# Altium schematic sheet Audio.SchDoc
size A4; SheetNumber: 5; SheetTotal: 9
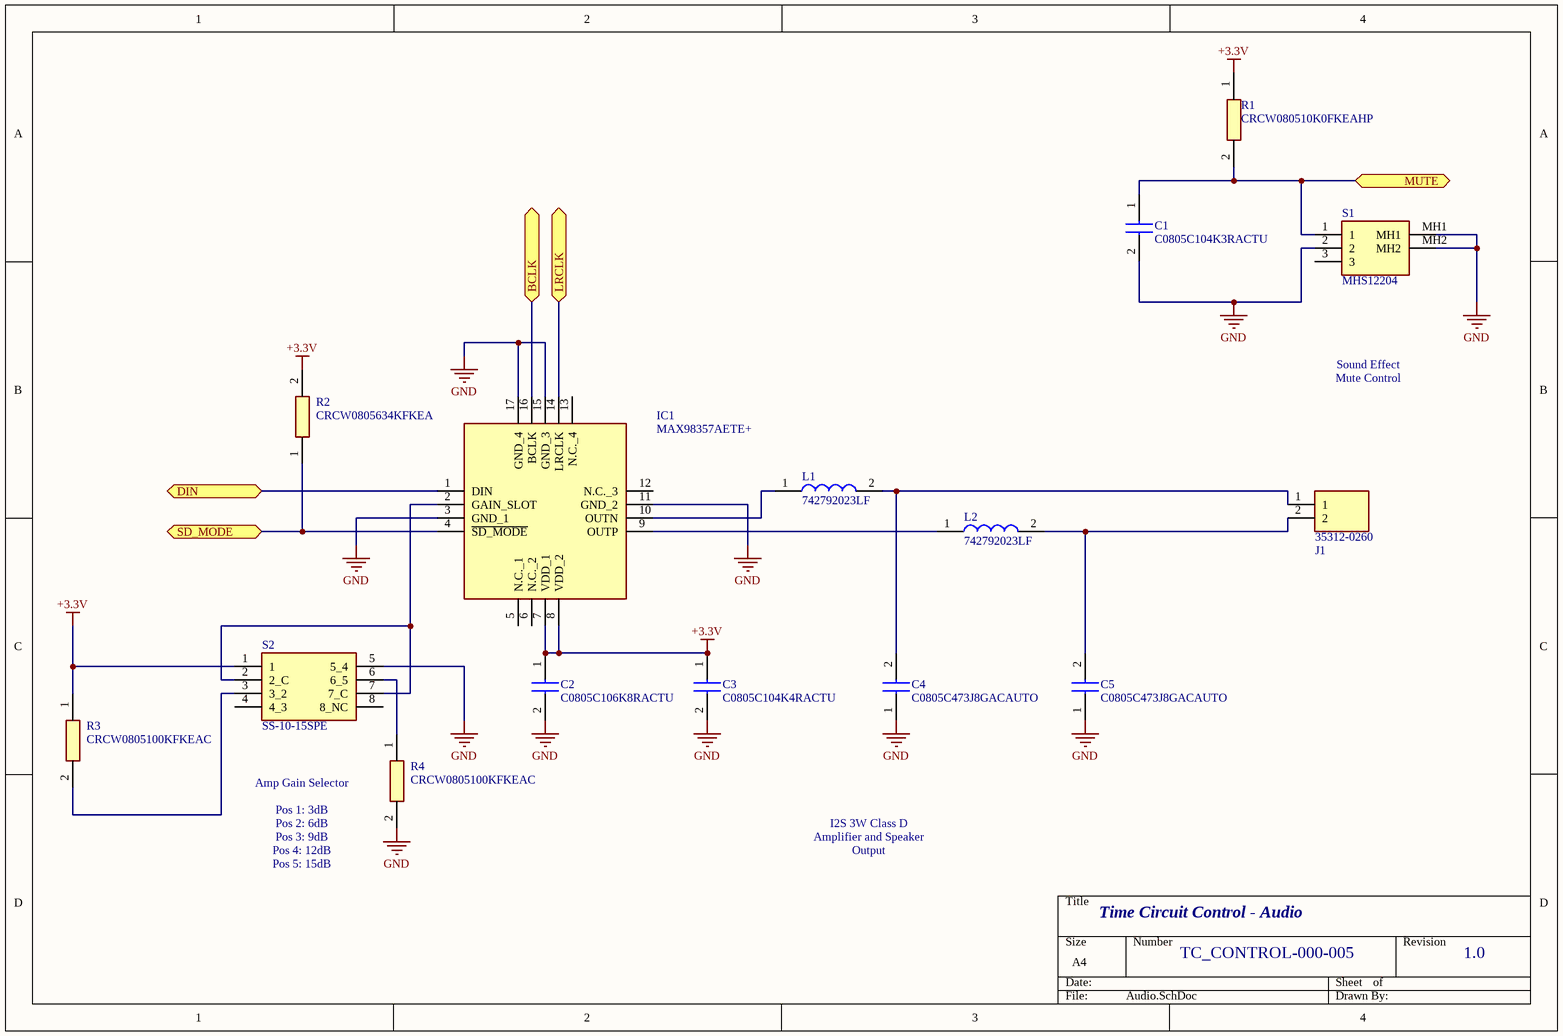
[diagram p0: Audio.SchDoc]

## Parts
C1  C0805C104K3RACTU  [CAPC2012X88N]
C2  C0805C106K8RACTU  [C0805]
C3  C0805C104K4RACTU  [CAPC2012X88N]
C4  C0805C473J8GACAUTO  [C0805]
C5  C0805C473J8GACAUTO  [C0805]
IC1  MAX98357AETE+  [QFN50P300X300X80-17N]
J1  35312-0260  [SHDR2W64P0X250_1X2_746X650X700P]
L1  742792023LF  [CAPC2012X110N]
L2  742792023LF  [CAPC2012X110N]
R1  CRCW080510K0FKEAHP  [RESC2012X60N]
R2  CRCW0805634KFKEA  [RESC2012X50N]
R3  CRCW0805100KFKEAC  [RESC2012X60N]
R4  CRCW0805100KFKEAC  [RESC2012X60N]
S1  MHS12204  [MHS12204]
S2  SS-10-15SPE  [SS1015SPE]

## Ports
BCLK, DIN, LRCLK, MUTE, SD_MODE

## Nets
+3.3V: C2.1 C3.1 IC1.7(VDD_1) IC1.8(VDD_2) R1.1 R2.2 R3.1 S2.1
GND: C1.2 C2.2 C3.2 C4.1 C5.1 IC1.3(GND_1) IC1.11(GND_2) IC1.15(GND_3) IC1.17(GND_4) R4.2 S1.2 S1.MH1 S1.MH2 S2.5(5_4)
BCLK: IC1.16(BCLK) ; port BCLK
DIN: IC1.1(DIN) ; port DIN
LRCLK: IC1.14(LRCLK) ; port LRCLK
MUTE: C1.1 R1.2 S1.1 ; port MUTE
SD_MODE: IC1.4(~{SD_MODE}) R2.1 ; port SD_MODE
NetC4_2: C4.2 J1.1 L1.2
NetC5_2: C5.2 J1.2 L2.2
NetIC1_2: IC1.2(GAIN_SLOT) S2.2(2_C) S2.7(7_C)
NetIC1_9: IC1.9(OUTP) L2.1
NetIC1_10: IC1.10(OUTN) L1.1
NetR3_2: R3.2 S2.3(3_2)
NetR4_1: R4.1 S2.6(6_5)

Not connected (* = marked no-connect by the designer): IC1 5(N.C._1) 6(N.C._2) 12(N.C._3) 13(N.C._4); S1 3; S2 4(4_3) 8(8_NC)

## Notes on the sheet
- Sound Effect
  Mute Control
- I2S 3W Class D
  Amplifier and Speaker Output
- (near R4) Amp Gain Selector
  Pos 1: 3dB
  Pos 2: 6dB
  Pos 3: 9dB
  Pos 4: 12dB
  Pos 5: 15dB
- Time Circuit Control - Audio
- TC_CONTROL-000-005
- 1.0

## Library data of the parts
C1 = C0805C104K3RACTU: Capacitor; Manufacturer_Name: Kemet; Datasheet Link: https://componentsearchengine.com/Datasheets/2/C0805C104K3RACTU.pdf; Height: 0.88mm; Manufacturer_Part_Number: C0805C104K3RACTU; Mouser Part Number: 80-C0805C104K3R; Mouser Price/Stock: https://www.mouser.co.uk/ProductDetail/KEMET/C0805C104K3RACTU?qs=zZwvocWqSRjmUvfNxkIN%2Fg%3D%3D; Arrow Part Number: C0805C104K3RACTU; Arrow Price/Stock: https://www.arrow.com/en/products/c0805c104k3ractu/kemet-corporation
C2 = C0805C106K8RACTU: Capacitor; Manufacturer_Name: KEMET; Datasheet Link: https://content.kemet.com/datasheets/KEM_C1002_X7R_SMD.pdf; Height: 1.1mm; Manufacturer_Part_Number: C0805C106K8RACTU; Mouser Part Number: 80-C0805C106K8R; Mouser Price/Stock: https://www.mouser.co.uk/ProductDetail/KEMET/C0805C106K8RACTU?qs=iP0bYSAMAFqUyr6Ql6ZwXw%3D%3D; Arrow Part Number: C0805C106K8RACTU; Arrow Price/Stock: https://www.arrow.com/en/products/c0805c106k8ractu/kemet-corporation?region=nac
C3 = C0805C104K4RACTU: Capacitor; Manufacturer_Name: Kemet; Datasheet Link: http://docs-emea.rs-online.com/webdocs/134c/0900766b8134ce68.pdf; Height: 0.88mm; Manufacturer_Part_Number: C0805C104K4RACTU; Arrow Part Number: C0805C104K4RACTU; Arrow Price/Stock: https://www.arrow.com/en/products/c0805c104k4ractu/kemet-corporation; Mouser Part Number: 80-C0805C104K4R; Mouser Price/Stock: https://www.mouser.co.uk/ProductDetail/KEMET/C0805C104K4RACTU?qs=Pc30aiB8zWWfqQNJWggt%252BA%3D%3D
C4 C5 = C0805C473J8GACAUTO: Capacitor; Manufacturer_Name: KEMET; Datasheet Link: https://content.kemet.com/datasheets/KEM_C1022_C0G_AUTO_SMD.pdf; Height: 1.1mm; Manufacturer_Part_Number: C0805C473J8GACAUTO; Mouser Part Number: 80-C0805C473J8GAUTO; Mouser Price/Stock: https://www.mouser.co.uk/ProductDetail/KEMET/C0805C473J8GACAUTO?qs=ds50AKTGxA9OMfMZaj%2FzcA%3D%3D
IC1 = MAX98357AETE+: Integrated Circuit; Manufacturer_Name: Maxim Integrated; Datasheet Link: https://datasheets.maximintegrated.com/en/ds/MAX98357A-MAX98357B.pdf; Height: 0.8mm; Manufacturer_Part_Number: MAX98357AETE+; Mouser Part Number: 700-MAX98357AETE+; Mouser Price/Stock: https://www.mouser.co.uk/ProductDetail/Maxim-Integrated/MAX98357AETE%2b?qs=AAveGqk956EyS6m3AmZeuw%3D%3D
J1 = 35312-0260: Connector; Manufacturer_Name: Molex; Datasheet Link: https://www.molex.com/pdm_docs/sd/353120260_sd.pdf; Height: 7mm; Manufacturer_Part_Number: 35312-0260; Mouser Part Number: 538-35312-0260; Mouser Price/Stock: https://www.mouser.co.uk/ProductDetail/Molex/35312-0260?qs=yk4OKw9K9iIhFPrGnuA8uA%3D%3D
L1 L2 = 742792023LF: Inductor; Manufacturer_Name: Wurth Elektronik; Datasheet Link: https://www.digikey.in/en/products/detail/w%C3%BCrth-elektronik/742792023/1639017?s=N4IgTCBcDaIOwBYxwJxgAxgMwAIQF0BfIA; Height: 1.1mm; Manufacturer_Part_Number: 742792023LF
R1 = CRCW080510K0FKEAHP: Resistor; Manufacturer_Name: Vishay; Datasheet Link: https://componentsearchengine.com/Datasheets/1/CRCW08051R00FKEAHP.pdf; Height: 0.6mm; Manufacturer_Part_Number: CRCW080510K0FKEAHP; Mouser Part Number: 71-CRCW080510K0FKEAH; Mouser Price/Stock: https://www.mouser.co.uk/ProductDetail/Vishay-Dale/CRCW080510K0FKEAHP/?qs=FlFvgi4rxBybVOW6oiRQjA%3D%3D; Arrow Part Number: CRCW080510K0FKEAHP; Arrow Price/Stock: https://www.arrow.com/en/products/crcw080510k0fkeahp/vishay
R2 = CRCW0805634KFKEA: Resistor; Manufacturer_Name: Vishay; Datasheet Link: http://www.vishay.com/docs/20035/dcrcwe3.pdf; Height: 0.5mm; Manufacturer_Part_Number: CRCW0805634KFKEA; Mouser Part Number: 71-CRCW0805634KFKEA; Mouser Price/Stock: https://www.mouser.com/Search/ProductDetail.aspx?qs=EhwKGB4UJflfbl5wVdh81Q%3d%3d
R3 R4 = CRCW0805100KFKEAC: Resistor; Manufacturer_Name: Vishay; Datasheet Link: https://mouser.componentsearchengine.com/Datasheets/1/CRCW0805100KFKEAC.pdf; Height: 0.6mm; Manufacturer_Part_Number: CRCW0805100KFKEAC; Mouser Part Number: 71-CRCW0805100KFKEAC; Mouser Price/Stock: https://www.mouser.co.uk/ProductDetail/Vishay-Dale/CRCW0805100KFKEAC?qs=E3Y5ESvWgWORJvbAiaO1ug%3D%3D; Arrow Part Number: CRCW0805100KFKEAC; Arrow Price/Stock: https://www.arrow.com/en/products/crcw0805100kfkeac/vishay?region=nac
S1 = MHS12204: Switch; Manufacturer_Name: TE Connectivity; Datasheet Link: https://www.te.com/commerce/DocumentDelivery/DDEController?Action=srchrtrv&DocNm=1825255&DocType=Customer+Drawing&DocLang=English&DocFormat=pdf&PartCntxt=1825255-1; Height: 12mm; Manufacturer_Part_Number: MHS12204; Mouser Part Number: 506-MHS12204; Mouser Price/Stock: https://www.mouser.co.uk/ProductDetail/TE-Connectivity-Alcoswitch/MHS12204?qs=x%2FgbKjZ2T%2FPUluB%2FWhqq0Q%3D%3D; Arrow Part Number: MHS12204; Arrow Price/Stock: https://www.arrow.com/en/products/mhs12204/te-connectivity?region=nac
S2 = SS-10-15SPE: Switch; Manufacturer_Name: Copal Electronics; Datasheet Link: https://www.nidec-copal-electronics.com/e/catalog/switch/ss-10&s-2050.pdf; Height: 7mm; Manufacturer_Part_Number: SS-10-15SPE